# EAGLE design OpenHealthV2 (EAGLE 7.2.0)
Desarollado por ALSW
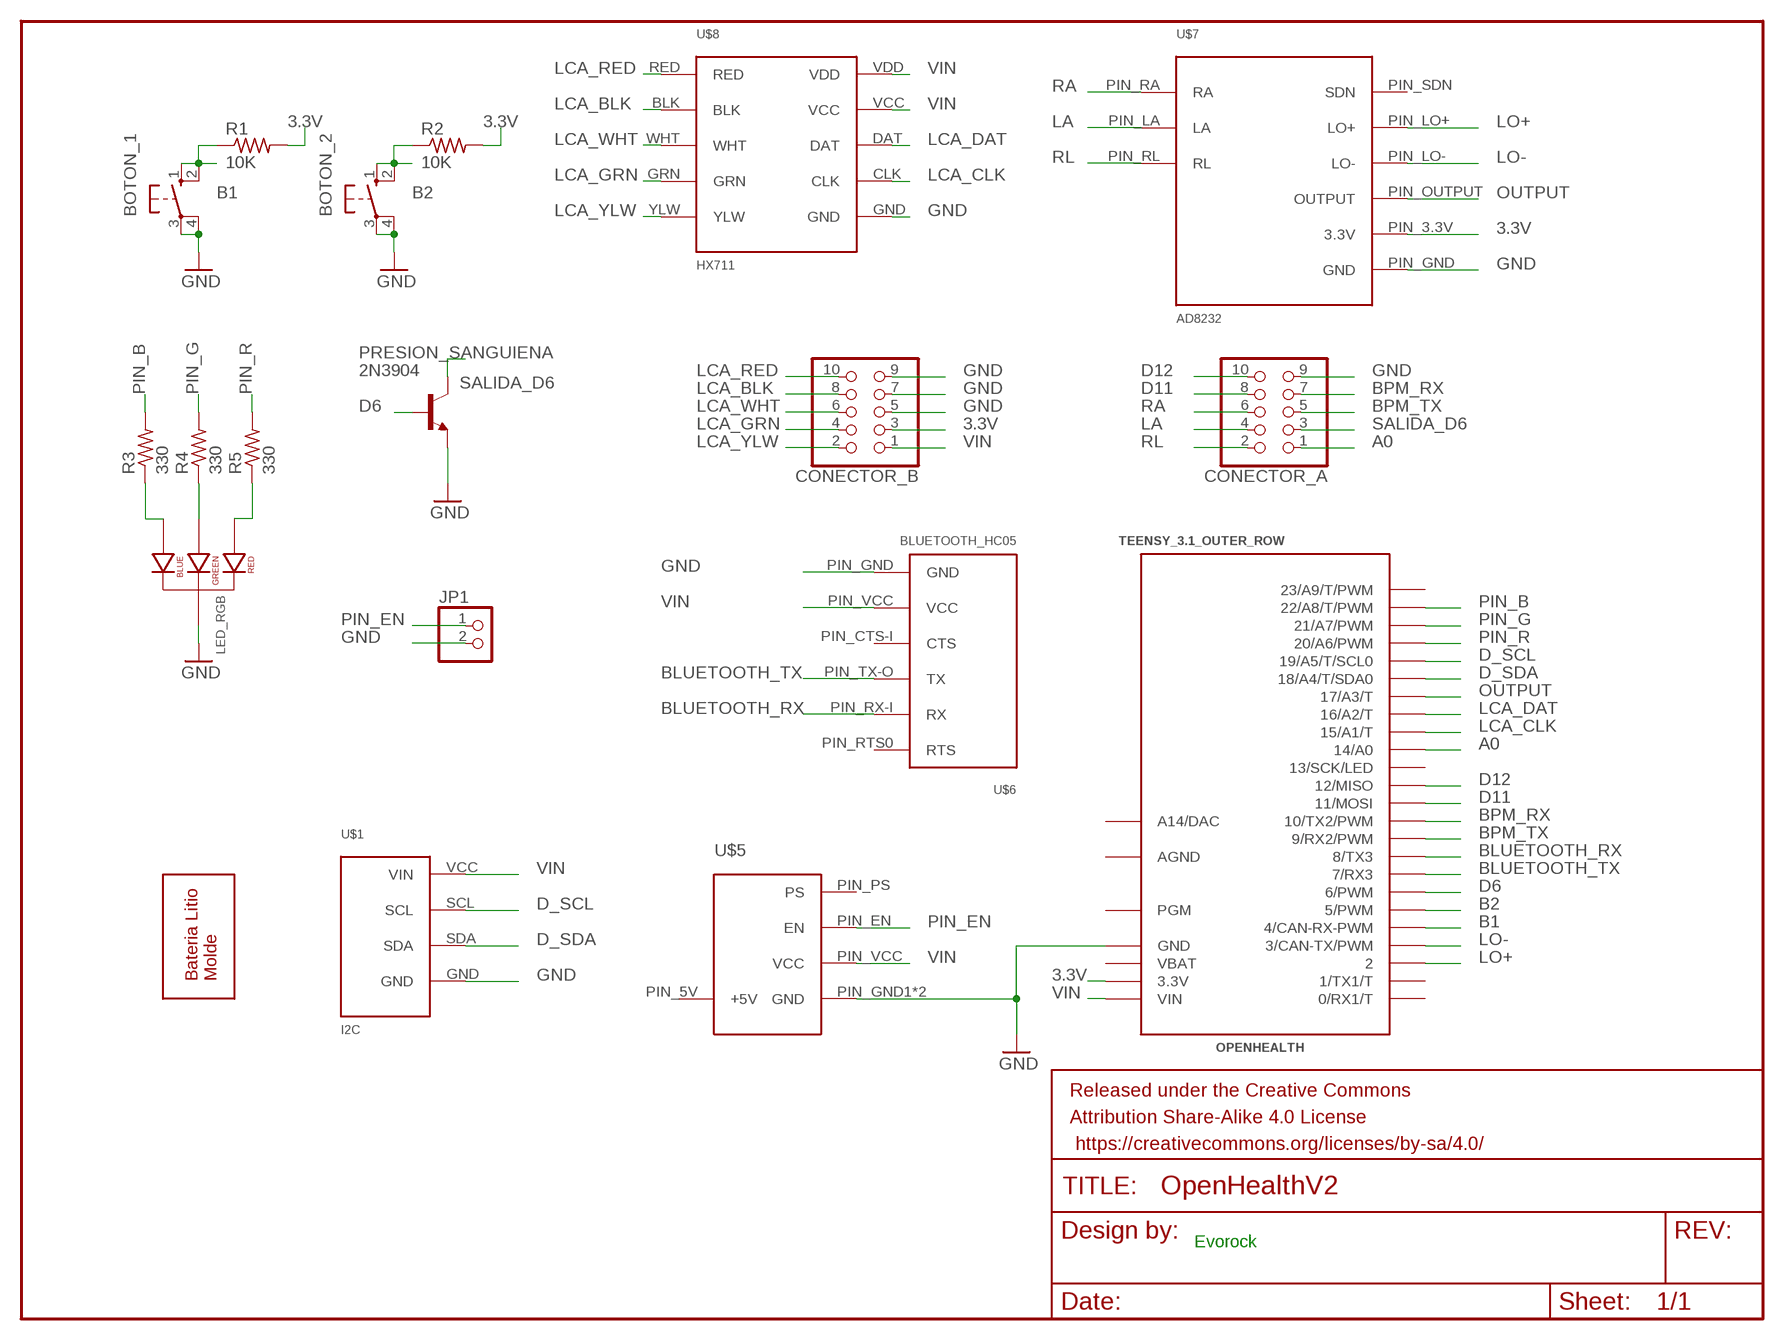
[diagram p0: schematic, sheet 1]

## Parts
BOTON_1  10-XX  [B3F-10XX]
BOTON_2  10-XX  [B3F-10XX]
CONECTOR_A  PINHD-2X5  [2X05]
CONECTOR_B  PINHD-2X5  [2X05]
FRAME1  FRAME-LETTER  [CREATIVE_COMMONS]
JP1  PINHD-1X2  [1X02]
LED_RGB  LED-RGB-CC-THRUCLEAR  [LED-RGB-THRU]
OPENHEALTH  TEENSY_3.1_OUTER_ROW  [TEENSY3-OUTER_ROW]
PRESION_SANGUIENA  2N3904  [TO92]
R1  10K  R-US_0204/7  [0204/7]
R2  10K  R-US_0204/7  [0204/7]
R3  330  R-US_0204/7  [0204/7]
R4  330  R-US_0204/7  [0204/7]
R5  330  R-US_0204/7  [0204/7]
U$1  I2C  [I2C]
U$2  BATERRY_MOLD  [BATTERY_MOLD]
U$5  LIPOWER  [LIPOWER]
U$6  BLUETOOTH_HC05  [BLUETOOTH_HC05]
U$7  AD8232  [AD8232]
U$8  HX711  [HX711]

## Nets
3.3V: CONECTOR_B.3 OPENHEALTH.3.3V OPENHEALTH.3.3V1(3.3V) R1.2 R2.2 U$7.PIN_3.3V(3.3V)
A0: CONECTOR_A.1 OPENHEALTH.14/A0
B1: BOTON_1.1(S) BOTON_1.2(S1) OPENHEALTH.4(4/CAN-RX-PWM) R1.1
B2: BOTON_2.1(S) BOTON_2.2(S1) OPENHEALTH.5(5/PWM) R2.1
BLUETOOTH_RX: OPENHEALTH.8(8/TX3) U$6.PIN_RX-I(RX)
BLUETOOTH_TX: OPENHEALTH.7(7/RX3) U$6.PIN_TX-O(TX)
BPM_RX: CONECTOR_A.7 OPENHEALTH.10(10/TX2/PWM)
BPM_TX: CONECTOR_A.5 OPENHEALTH.9(9/RX2/PWM)
D6: OPENHEALTH.6(6/PWM) PRESION_SANGUIENA.2(B)
D11: CONECTOR_A.8 OPENHEALTH.11(11/MOSI)
D12: CONECTOR_A.10 OPENHEALTH.12(12/MISO)
D_SCL: OPENHEALTH.19/A5(19/A5/T/SCL0) U$1.SCL
D_SDA: OPENHEALTH.18/A4(18/A4/T/SDA0) U$1.SDA
GND: BOTON_1.3(P) BOTON_1.4(P1) BOTON_2.3(P) BOTON_2.4(P1) CONECTOR_A.9 CONECTOR_B.5 CONECTOR_B.7 CONECTOR_B.9 JP1.2 LED_RGB.2(CATHODE) OPENHEALTH.GND OPENHEALTH.GND1(GND) PRESION_SANGUIENA.3(E) U$1.GND U$5.PIN_GND1(GND) U$5.PIN_GND2(GND) U$6.PIN_GND(GND) U$7.PIN_GND(GND) U$8.GND
LA: CONECTOR_A.4 U$7.PIN_LA(LA)
LCA_BLK: CONECTOR_B.8 U$8.BLK
LCA_CLK: OPENHEALTH.15/A1(15/A1/T) U$8.CLK
LCA_DAT: OPENHEALTH.16/A2(16/A2/T) U$8.DAT
LCA_GRN: CONECTOR_B.4 U$8.GRN
LCA_RED: CONECTOR_B.10 U$8.RED
LCA_WHT: CONECTOR_B.6 U$8.WHT
LCA_YLW: CONECTOR_B.2 U$8.YLW
LO+: OPENHEALTH.2 U$7.PIN_LO+(LO+)
LO-: OPENHEALTH.3(3/CAN-TX/PWM) U$7.PIN_LO-(LO-)
N$2: LED_RGB.4(BLUE_CATHODE) R3.1
N$3: LED_RGB.1(RED_CATHODE) R5.1
N$4: LED_RGB.3(GREEN_CATHODE) R4.1
OUTPUT: OPENHEALTH.17/A3(17/A3/T) U$7.PIN_OUTPUT(OUTPUT)
PIN_B: OPENHEALTH.22/A8(22/A8/T/PWM) R3.2
PIN_EN: JP1.1 U$5.PIN_EN(EN)
PIN_G: OPENHEALTH.21/A7(21/A7/PWM) R4.2
PIN_R: OPENHEALTH.20/A6(20/A6/PWM) R5.2
RA: CONECTOR_A.6 U$7.PIN_RA(RA)
RL: CONECTOR_A.2 U$7.PIN_RL(RL)
SALIDA_D6: CONECTOR_A.3 PRESION_SANGUIENA.1(C)
VIN: CONECTOR_B.1 OPENHEALTH.VIN U$1.VCC(VIN) U$5.PIN_VCC(VCC) U$6.PIN_VCC(VCC) U$8.VCC U$8.VDD
Unconnected: OPENHEALTH.0(0/RX1/T) OPENHEALTH.1(1/TX1/T) OPENHEALTH.13(13/SCK/LED) OPENHEALTH.23/A9(23/A9/T/PWM) OPENHEALTH.PGM OPENHEALTH.RESET/DAC(A14/DAC) U$5.PIN_5V(+5V) U$5.PIN_PS(PS) U$6.PIN_CTS-I(CTS) U$6.PIN_RTS0(RTS) U$7.PIN_SDN(SDN)

## Notes on the sheet
- Evorock

## Power pins joined to a net without a drawn wire
AGND: OPENHEALTH.AGND
VBAT: OPENHEALTH.VBAT

## Library data of the parts
BOTON_1 BOTON_2 = switch-omron:10-XX: OMRON SWITCH; MPN: B3F-1000; OC_FARNELL: 176432; OC_NEWARK: 36M3542
CONECTOR_A CONECTOR_B = pinhead:PINHD-2X5: PIN HEADER
FRAME1 = SparkFun-Aesthetics:FRAME-LETTER: Schematic Frame Standard 8.5x11 US Letter frame
JP1 = pinhead:PINHD-1X2: PIN HEADER
LED_RGB = SparkFun-LED:LED-RGB-CC-THRU: RGB Through-hole common cathode LED SparkFun Storefront: COM-00105 (Clear) COM-09264 (Diffuse); PROD_ID: DIO-08418
OPENHEALTH = Teensy_3_and_LC_Series_Boards_v1.1:TEENSY_3.1_OUTER_ROW: Footprint for Teensy 3.1 or 3.2 board using all pin connections on the outer perimeter
PRESION_SANGUIENA = transistor:2N3904: NPN TRANSISTOR
R1-R5 = resistor:R-US_: RESISTOR, American symbol
U$1 = OpenHealth:I2C
U$2 = OpenHealth:BATERRY_MOLD
U$5 = Bateria:LIPOWER: LIBRERIA PARA EL LIPOWER CHARGER DE SPARKFUN
U$6 = OpenHealth:BLUETOOTH_HC05
U$7 = OpenHealth:AD8232
U$8 = OpenHealth:HX711

## Board
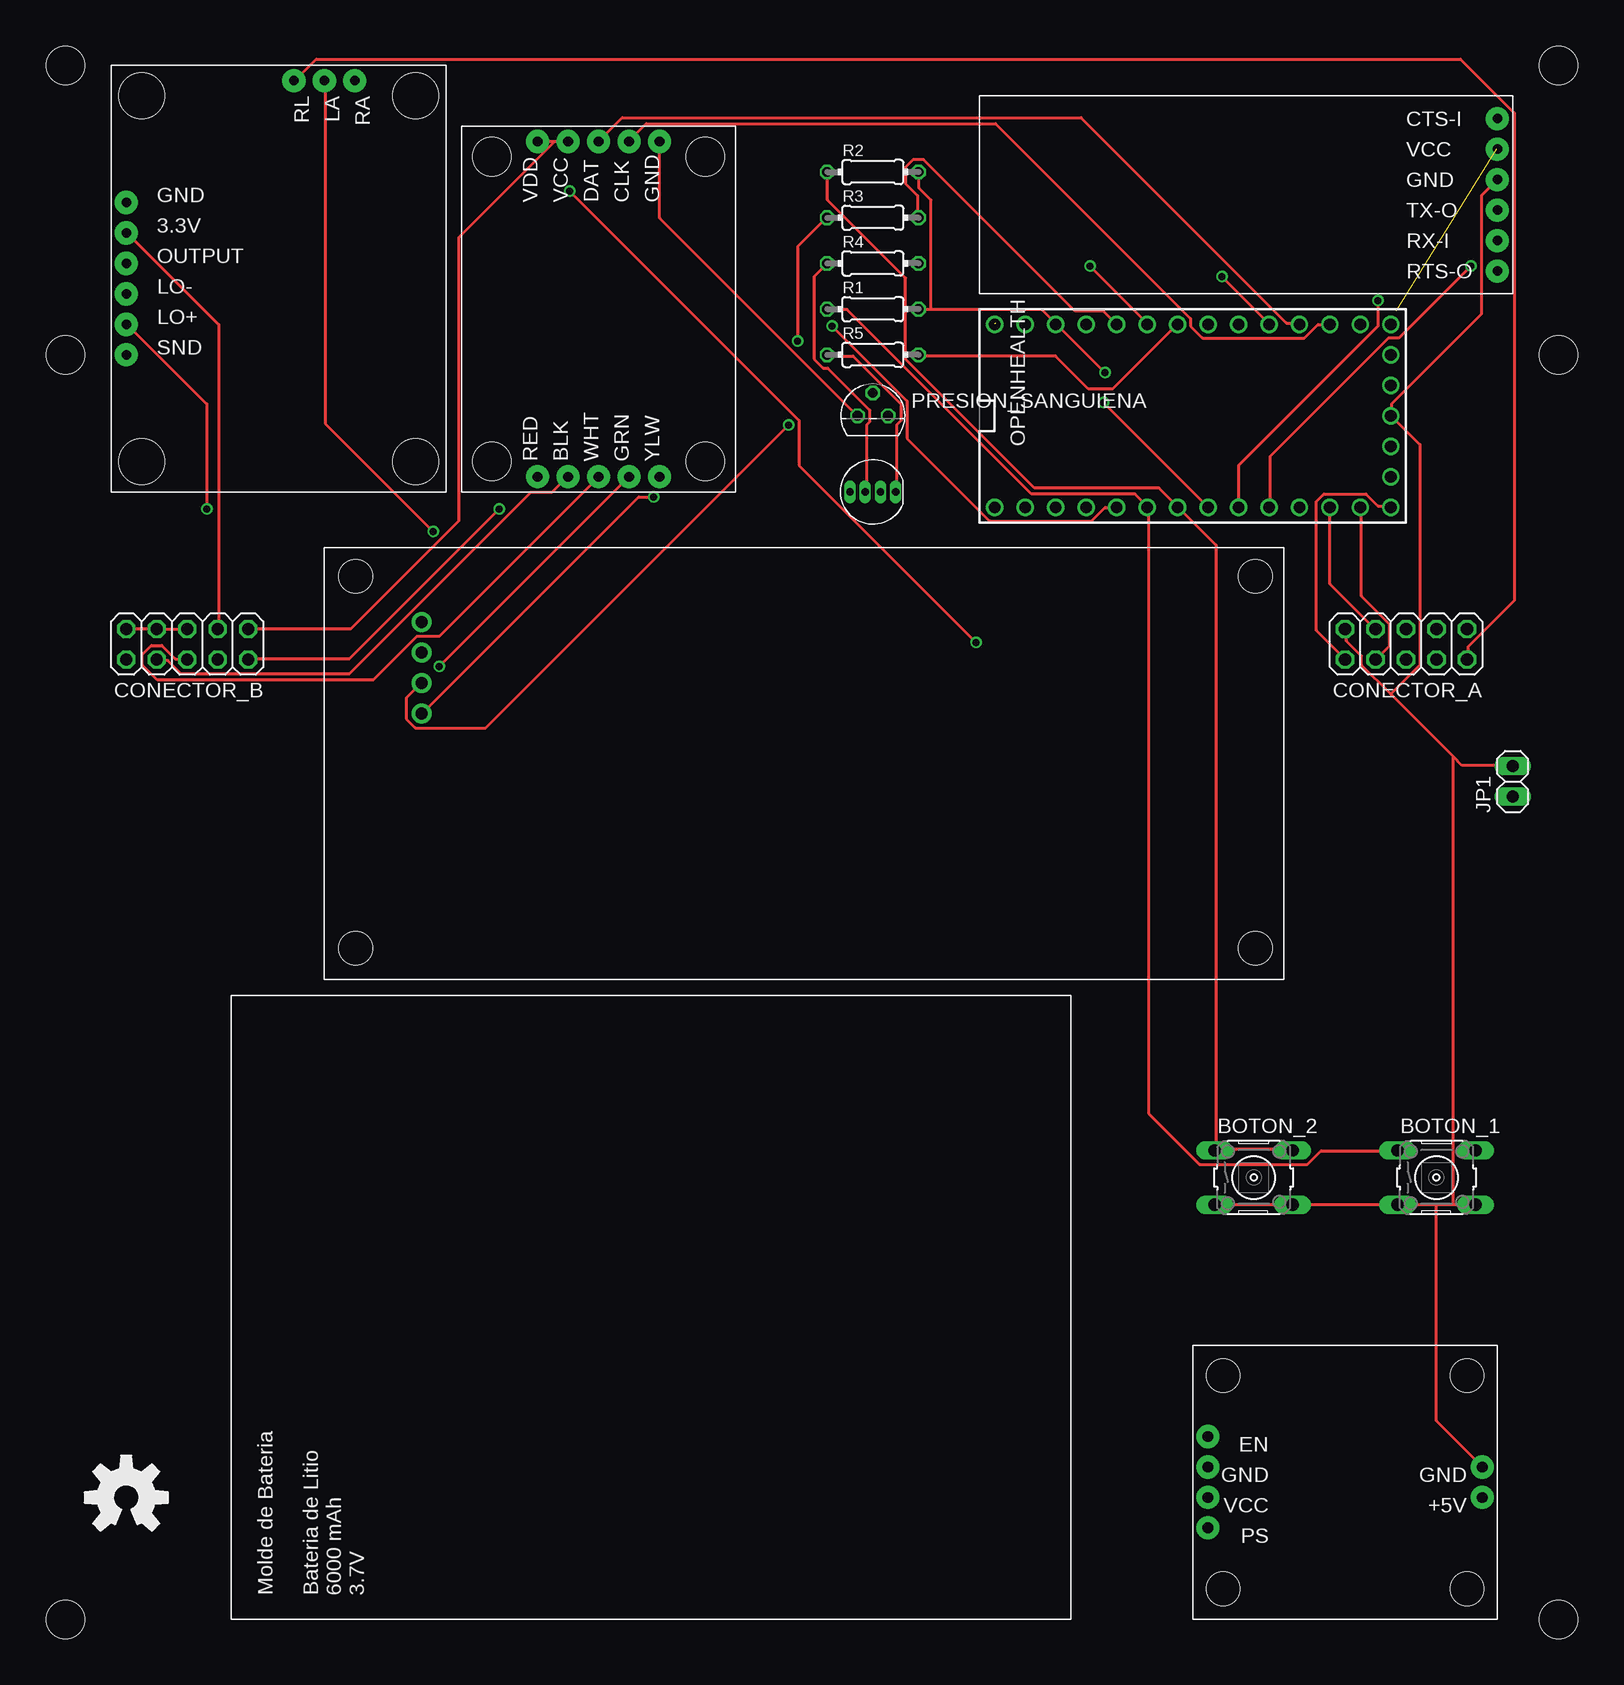
[diagram p1: board, top side]
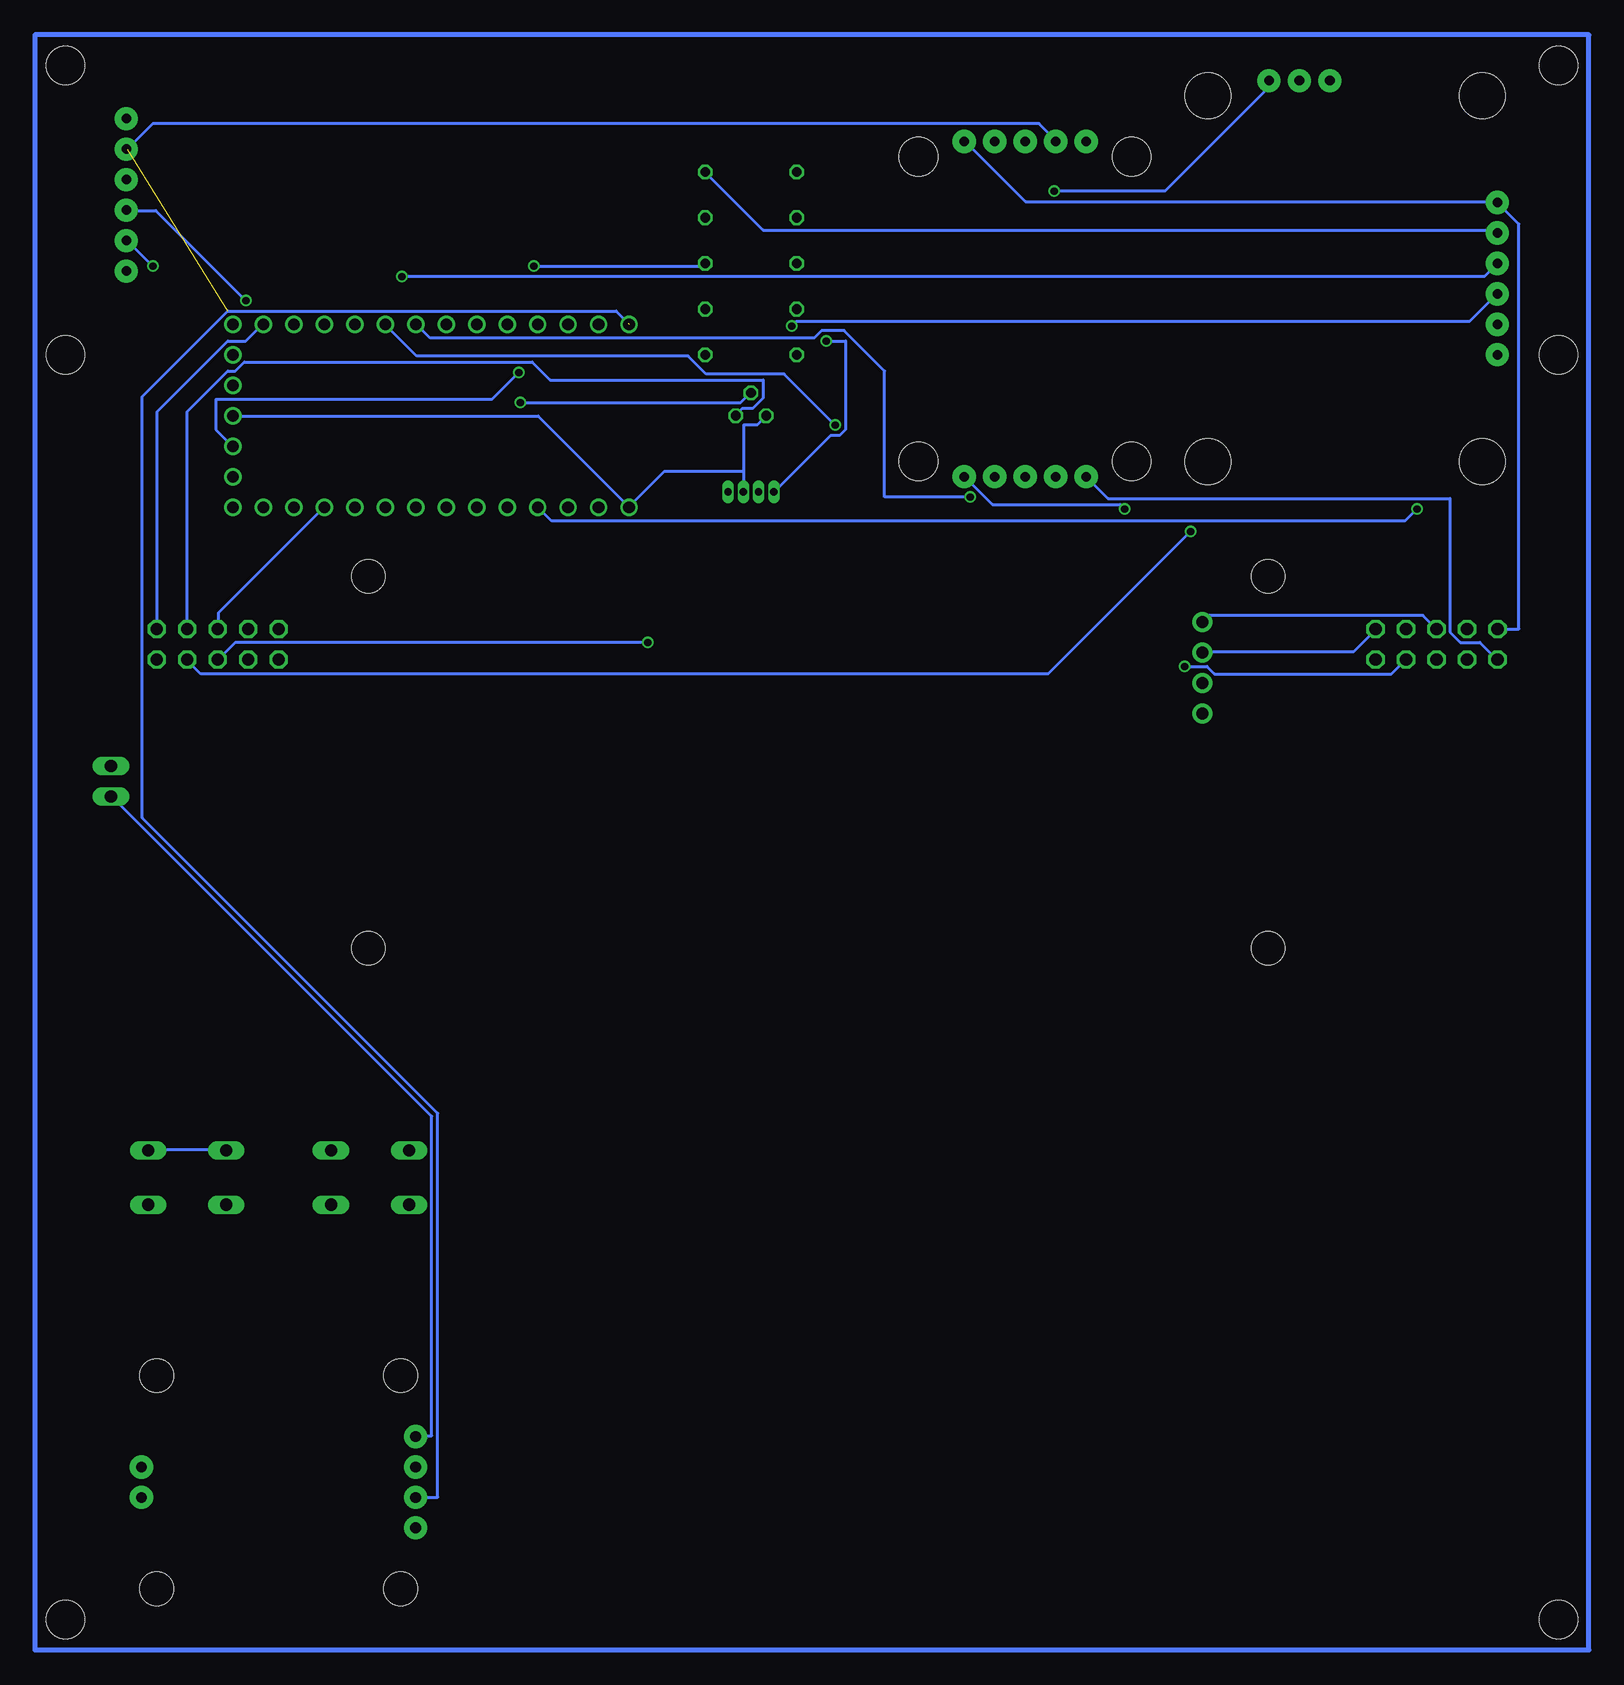
[diagram p2: board, bottom side, seen from below]

No outline drawn. Coordinates in mm, seen from the top.
Copper layers (1*16): Top 0.0356mm / dielectric 1.5011mm / Bottom 0.0356mm
Design rules "oshpark-2layer": minimum track width 6mil, minimum drill 13mil, track to track 6mil, track to pad 6mil, pad to pad 6mil, via to via 6mil, smd to smd 6mil, copper to edge 15mil, drill to drill 6mil, minimum pad ring 7mil, minimum via ring 7mil, stop-mask expansion 2.5mil, vias tented up to drill 0mil, thermal gap 10mil
Holes 3.2 mm at -66.04,20.32 -66.04,149.86 58.42,149.86 58.42,125.73 58.42,20.32 -66.04,125.73

### Footprints (pad centres in the part's own frame; a part is rotated, then mirrored left to right if it is on the bottom)
B3F-10XX = drill 1.016 long: 1 -3.251,2.261; 2 3.251,2.261; 3 -3.251,-2.261; 4 3.251,-2.261
2X05 = drill 1.016 octagon: 1 -5.08,-1.27; 2 -5.08,1.27; 3 -2.54,-1.27; 4 -2.54,1.27; 5 0,-1.27; 6 0,1.27; 7 2.54,-1.27; 8 2.54,1.27; 9 5.08,-1.27; 10 5.08,1.27
1X02 = drill 1.016 long: 1 -1.27,0; 2 1.27,0
LED-RGB-THRU = drill 0.6 pad 0.813 long: 1 1.905,0; 2 0.635,0; 3 -0.635,0; 4 -1.905,0
TEENSY3-OUTER_ROW = drill 0.965: 0 -7.62,13.97; 1 -7.62,11.43; 2 -7.62,8.89; 3 -7.62,6.35; 3.3V 7.62,11.43; 3.3V1 -2.54,-16.51; 4 -7.62,3.81; 5 -7.62,1.27; 6 -7.62,-1.27; 7 -7.62,-3.81; 8 -7.62,-6.35; 9 -7.62,-8.89; 10 -7.62,-11.43; 11 -7.62,-13.97; 12 -7.62,-16.51; 13 7.62,-16.51; 14/A0 7.62,-13.97; 15/A1 7.62,-11.43; 16/A2 7.62,-8.89; 17/A3 7.62,-6.35; 18/A4 7.62,-3.81; 19/A5 7.62,-1.27; 20/A6 7.62,1.27; 21/A7 7.62,3.81; 22/A8 7.62,6.35; 23/A9 7.62,8.89; AGND 7.62,13.97; GND -7.62,16.51; GND1 0,-16.51; PGM 2.54,-16.51; RESET/DAC 5.08,-16.51; VBAT -5.08,-16.51; VIN 7.62,16.51
TO92 = drill 0.813 octagon: 1 1.27,0; 2 0,1.905; 3 -1.27,0
0204/7 = drill 0.813 octagon: 1 -3.81,0; 2 3.81,0
I2C = drill 1 pad 1.676: GND 8.1,29.8; SCL 8.1,22.18; SDA 8.1,24.72; VCC 8.1,27.26 | hole 2.8: 2.6,2.61; 2.6,33.61; 77.6,33.61; 77.6,2.61
LIPOWER = drill 0.9 pad 1.93: PIN_5V 10.16,1.27; PIN_EN 15.24,24.13; PIN_GND1 12.7,24.13; PIN_GND2 12.7,1.27; PIN_PS 7.62,24.13; PIN_VCC 10.16,24.13 | hole 2.8: 20.32,22.86; 20.32,2.54; 2.54,2.54; 2.54,22.86
BLUETOOTH_HC05 = drill 0.8 pad 1.93: PIN_CTS-I 43.18,14.605; PIN_GND 43.18,9.525; PIN_RTS0 43.18,1.905; PIN_RX-I 43.18,4.445; PIN_TX-O 43.18,6.985; PIN_VCC 43.18,12.065
AD8232 = drill 0.8 pad 1.93: PIN_3.3V 13.97,1.27; PIN_GND 11.43,1.27; PIN_LA 1.27,17.78; PIN_LO+ 21.59,1.27; PIN_LO- 19.05,1.27; PIN_OUTPUT 16.51,1.27; PIN_RA 1.27,20.32; PIN_RL 1.27,15.24; PIN_SDN 24.13,1.27 | hole 3.81: 33.02,25.4; 2.54,25.4; 2.54,2.54; 33.02,2.54
HX711 = drill 0.8 pad 1.93: BLK 1.27,13.97; CLK 29.21,8.89; DAT 29.21,11.43; GND 29.21,6.35; GRN 1.27,8.89; RED 1.27,16.51; VCC 29.21,13.97; VDD 29.21,16.51; WHT 1.27,11.43; YLW 1.27,6.35 | hole 3.2: 2.54,20.32; 27.94,20.32; 2.54,2.54; 27.94,2.54

### Placement (x,y rotation side)
BOTON_1  48.26,57.15 0 top
BOTON_2  33.02,57.15 0 top
CONECTOR_A  45.72,101.6 180 top
CONECTOR_B  -55.88,101.6 180 top
FRAME1  -46.99,8.89 0 top
JP1  54.61,90.17 90 top
LED_RGB  1.27,114.3 0 top
OPENHEALTH  27.94,120.65 90 top
PRESION_SANGUIENA  1.27,120.65 0 top
R1  1.27,129.54 0 top
R2  1.27,140.97 0 top
R3  1.27,137.16 0 top
R4  1.27,133.35 0 top
R5  1.27,125.73 0 top
U$1  -44.45,73.66 0 top
U$2  17.78,20.32 90 top
U$3  [OSHW-LOGO-L]  -60.96,30.48 0 top
U$5  53.34,20.32 90 top
U$6  10.16,130.81 0 top
U$7  -62.23,149.86 270 top
U$8  -10.16,114.3 90 top

### Tracks (layer width: path | path; a pad name or v marks a point on that pad's centre or on a via)
3.3V  (via drill 0.61)
  Top 0.254: CONECTOR_B.3 -53.25,102.88 -53.25,128.25 -60.88,135.88 U$7.PIN_3.3V | 6.12,129.5 15.38,129.5 16.5,128.38 OPENHEALTH.3.3V 16.62,128.25 v20.62,124.25 | 6.12,129.5 5.12,129.5 R1.2 | 6.12,129.5 6.12,138.62 5.12,139.62 5.12,140.88 R2.2
  Bottom 0.254: v20.62,124.25 22.88,122 45.88,122 45.88,119.5 44.5,118.12 OPENHEALTH.3.3V1 | U$7.PIN_3.3V -60.88,136 -60.75,136.12 0.25,136.12 5,140.88 R2.2
A0
  Bottom 0.254: OPENHEALTH.14/A0 42,128.25 43.38,126.88 44.88,126.88 50.75,121 50.75,102.88 CONECTOR_A.1
B1
  Top 0.254: R1.1 -2.5,129.5 -0.88,129.5 14.5,114.12 23.12,114.12 24.12,113.12 OPENHEALTH.4 24.25,113 24.25,62.5 28.5,58.25 37.5,58.25 38.62,59.38 45,59.38 BOTON_1.1
  Bottom 0.254: BOTON_1.1 45.12,59.5 51.5,59.5 BOTON_1.2
B2
  Top 0.254: BOTON_2.2 36.25,59.5 29.88,59.5 BOTON_2.1 29.88,59.62 29.88,109.88 26.75,113 OPENHEALTH.5 26.62,113.12 25.12,114.62 14.75,114.62 4,125.38 4,132.12 -2.5,138.62 -2.5,140.88 R2.1
BLUETOOTH_RX  (via drill 0.61)
  Top 0.254: v51.12,133.12 45.12,127.12 44.25,127.12 34.38,117.25 34.38,113.12 OPENHEALTH.8
  Bottom 0.254: v51.12,133.12 53.25,135.25 U$6.PIN_RX-I
BLUETOOTH_TX  (via drill 0.61)
  Top 0.254: OPENHEALTH.7 31.75,116.5 43.38,128.12 v43.38,130.25
  Bottom 0.254: v43.38,130.25 50.88,137.75 53.25,137.75 U$6.PIN_TX-O
BPM_RX
  Top 0.254: OPENHEALTH.10 39.38,113 39.38,106.62 43.12,102.88 CONECTOR_A.7
BPM_TX
  Bottom 0.254: OPENHEALTH.9 36.88,113 45.62,104.25 45.62,102.88 CONECTOR_A.5
D6  (via drill 0.61)
  Top 0.254: v20.5,121.75 29.12,113.12 OPENHEALTH.6
  Bottom 0.254: v20.5,121.75 2.12,121.75 1.38,122.5 PRESION_SANGUIENA.2
D11
  Top 0.254: OPENHEALTH.11 42,113 42,105.62 44.38,103.25 44.38,101.5 43.25,100.38 CONECTOR_A.8
D12
  Top 0.254: OPENHEALTH.12 44.38,113.12 43.38,113.12 42.38,114.12 38.88,114.12 38.25,113.5 38.25,102.75 40.62,100.38 CONECTOR_A.10
D_SCL  (via drill 0.61)
  Top 0.254: v-17,113.88 -18.25,113.88 -36.25,95.88 U$1.SCL
  Bottom 0.254: v-17,113.88 -9.88,113.88 -9.88,124.38 -6.5,127.75 -4.62,127.75 -4,127.12 28,127.12 29.12,128.25 OPENHEALTH.19/A5
D_SDA  (via drill 0.61)
  Top 0.254: v-5.75,119.88 -31,94.62 -36.88,94.62 -37.62,95.38 -37.62,97.12 -36.38,98.38 U$1.SDA
  Bottom 0.254: v-5.75,119.88 -1.5,124.12 5,124.12 6.5,125.62 29.12,125.62 31.75,128.25 OPENHEALTH.18/A4
GND
  Top 0.254: CONECTOR_B.9 -60.88,102.88 -58.5,102.88 CONECTOR_B.7 -58.38,102.88 -56,102.88 CONECTOR_B.5 | U$8.GND -16.5,137.12 0,120.62 PRESION_SANGUIENA.3 | BOTON_2.3 29.88,54.88 36.25,54.88 BOTON_2.4 36.38,54.88 45,54.88 BOTON_1.3 45.12,54.88 48.25,54.88 | 49.62,54.88 51.5,54.88 BOTON_1.4 | 49.62,54.88 48.25,54.88 | 48.25,54.88 48.25,36.88 52,33.12 U$5.PIN_GND2 | 49.69,92.19 50.38,91.5 54.5,91.5 JP1.2 | 49.69,92.19 44.44,97.44 | 44.44,97.44 42,99.88 42,100.62 40.75,101.88 40.75,102.75 CONECTOR_A.9 | U$6.PIN_GND 53.25,140.25 52,139 52,129.12 44.5,121.62 44.5,120.75 OPENHEALTH.GND1 44.5,120.62 46.88,118.25 46.88,99.88 44.44,97.44 | 49.62,54.88 49.62,92.12 49.69,92.19
  Bottom 0.254: CONECTOR_B.5 -54.75,104 -36.88,104 -36.38,103.5 U$1.GND | CONECTOR_B.9 -61,102.88 -62.75,102.88 -62.75,136.62 -61,138.38 U$7.PIN_GND -60.88,138.5 -21.62,138.5 -16.62,143.5 U$8.GND | 1.88,116 1.88,119.88 0.75,119.88 0,120.62 PRESION_SANGUIENA.3 | 1.88,116 1.88,114.38 LED_RGB.2 | 1.88,116 8.5,116 11.38,113.12 OPENHEALTH.GND 11.5,113.12 19,120.62 44.38,120.62 OPENHEALTH.GND1
LA  (via drill 0.61)
  Top 0.254: v-35.38,111 -44.38,120 -44.38,148.5 U$7.PIN_LA
  Bottom 0.254: v-35.38,111 -23.5,99.12 47.12,99.12 48.25,100.25 CONECTOR_A.4
LCA_BLK
  Top 0.254: CONECTOR_B.8 -58.38,100.25 -57.5,100.25 -56.38,99.12 -42.38,99.12 -27.25,114.25 -25.5,114.25 -24.25,115.5 U$8.BLK
LCA_CLK
  Top 0.254: OPENHEALTH.15/A1 39.25,128.25 38.38,128.25 37.25,127.12 28.75,127.12 27.75,128.12 27.75,128.75 11.5,145 -17.62,145 -19,143.62 U$8.CLK
LCA_DAT
  Top 0.254: OPENHEALTH.16/A2 36.75,128.38 35.75,128.38 18.62,145.5 -19.62,145.5 -21.5,143.62 U$8.DAT
LCA_GRN  (via drill 0.61)
  Top 0.254: v-34.88,99.75 -19.12,115.5 U$8.GRN
  Bottom 0.254: v-34.88,99.75 -36.75,99.75 -37.38,99.12 -52.12,99.12 -53.25,100.25 CONECTOR_B.4
LCA_RED
  Bottom 0.254: CONECTOR_B.10 -60.88,100.38 -59.5,101.75 -57.88,101.75 -57,102.62 -57,113.75 -28.5,113.75 -26.75,115.5 U$8.RED
LCA_WHT
  Top 0.254: CONECTOR_B.6 -56,100.38 -56.88,100.38 -58,101.5 -58.88,101.5 -59.62,100.75 -59.62,99.88 -58.38,98.62 -40.38,98.62 -36.75,102.25 -34.88,102.25 -21.62,115.5 U$8.WHT
LCA_YLW  (via drill 0.61)
  Top 0.254: v-29.88,112.88 -42.38,100.38 -50.75,100.38 CONECTOR_B.2
  Bottom 0.254: v-29.88,112.88 -29.5,113.25 -18.88,113.25 -16.62,115.5 U$8.YLW
LO+  (via drill 0.61)
  Top 0.254: v-54.25,112.88 -54.25,121.62 -60.88,128.25 U$7.PIN_LO+
  Bottom 0.254: v-54.25,112.88 -53.25,111.88 17.88,111.88 19,113 OPENHEALTH.2
LO-  (via drill 0.61)
  Top 0.254: v-2.12,128.12 4.12,121.88 4.12,118.75 11,111.88 19.5,111.88 20.62,113 21.5,113 OPENHEALTH.3
  Bottom 0.254: v-2.12,128.12 -2.5,128.5 -58.62,128.5 -60.88,130.75 U$7.PIN_LO-
N$2  (via drill 0.61)
  Top 0.254: v-5,126.88 -5,134.75 -2.62,137.12 R3.1
  Bottom 0.254: v-5,126.88 -6.62,126.88 -6.62,119.5 -6.12,119 -5.38,119 -0.75,114.38 LED_RGB.4
N$3
  Top 0.254: LED_RGB.1 3.25,114.38 3.25,119.88 3.62,120.25 3.62,121.62 -0.38,125.62 -2.5,125.62 R5.1
N$4
  Top 0.254: LED_RGB.3 0.75,114.38 0.75,119.88 1,120.12 1,121.12 -2.5,124.62 -2.88,124.62 -3.62,125.38 -3.62,132.25 -2.62,133.25 R4.1
N$6
  Bottom 0.406: -68.58,17.78 -68.58,152.4 60.96,152.4 60.96,17.78 -68.58,17.78
OUTPUT  (via drill 0.61)
  Top 0.254: v30.38,132.25 34.25,128.38 OPENHEALTH.17/A3
  Bottom 0.254: v30.38,132.25 -59.88,132.25 -60.88,133.25 U$7.PIN_OUTPUT
PIN_B
  Top 0.254: R3.2 5,137.25 5,139 4,140 4,141.38 4.62,142 5.5,142 18.12,129.38 20.5,129.38 21.5,128.38 OPENHEALTH.22/A8
PIN_EN
  Bottom 0.254: JP1.1 54.5,88.88 27.88,62.25 27.88,35.62 29.12,35.62 U$5.PIN_EN
PIN_G  (via drill 0.61)
  Top 0.254: v19.38,133.12 24.12,128.38 OPENHEALTH.21/A7
  Bottom 0.254: v19.38,133.12 5.25,133.12 5.12,133.25 R4.2
PIN_R
  Top 0.254: R5.2 5.12,125.62 16.5,125.62 19.25,122.88 21.25,122.88 26.62,128.25 OPENHEALTH.20/A6
RA  (via drill 0.61)
  Top 0.254: v9.88,101.75 -4.88,116.5 -4.88,120.25 v-24,139.38
  Bottom 0.254: v9.88,101.75 44.25,101.75 45.62,100.38 CONECTOR_A.6 | v-24,139.38 -33.25,139.38 -41.88,148 -41.88,148.5 U$7.PIN_RA
RL
  Top 0.254: CONECTOR_A.2 50.88,100.38 50.88,101.38 54.75,105.25 54.75,145.88 50.25,150.38 -45.12,150.38 -46.88,148.62 U$7.PIN_RL
SALIDA_D6
  Bottom 0.254: PRESION_SANGUIENA.1 2.5,120.75 2,121.25 1.12,121.25 0.25,122.12 0.25,123.62 18,123.62 19.5,125.12 43.5,125.12 44.25,124.38 44.88,124.38 48.25,121 CONECTOR_A.3
VIN  (2 unrouted)
  Top 0.254: -25.38,143.5 -24.25,143.5 U$8.VCC | -25.38,143.5 -26.62,143.5 U$8.VDD | CONECTOR_B.1 -50.75,102.88 -42.25,102.88 -33.25,111.88 -33.25,135.5 -25.38,143.38 -25.38,143.5
  Bottom 0.254: CONECTOR_B.1 -50.75,102.75 -49,101 -36.38,101 U$1.VCC | U$6.PIN_VCC 53.25,142.88 51.12,145 -22.75,145 -24.12,143.62 U$8.VCC | 11.5,128.38 12.5,129.38 44.88,129.38 52,122.25 52,87.12 27.38,62.5 27.38,30.5 29.12,30.5 U$5.PIN_VCC